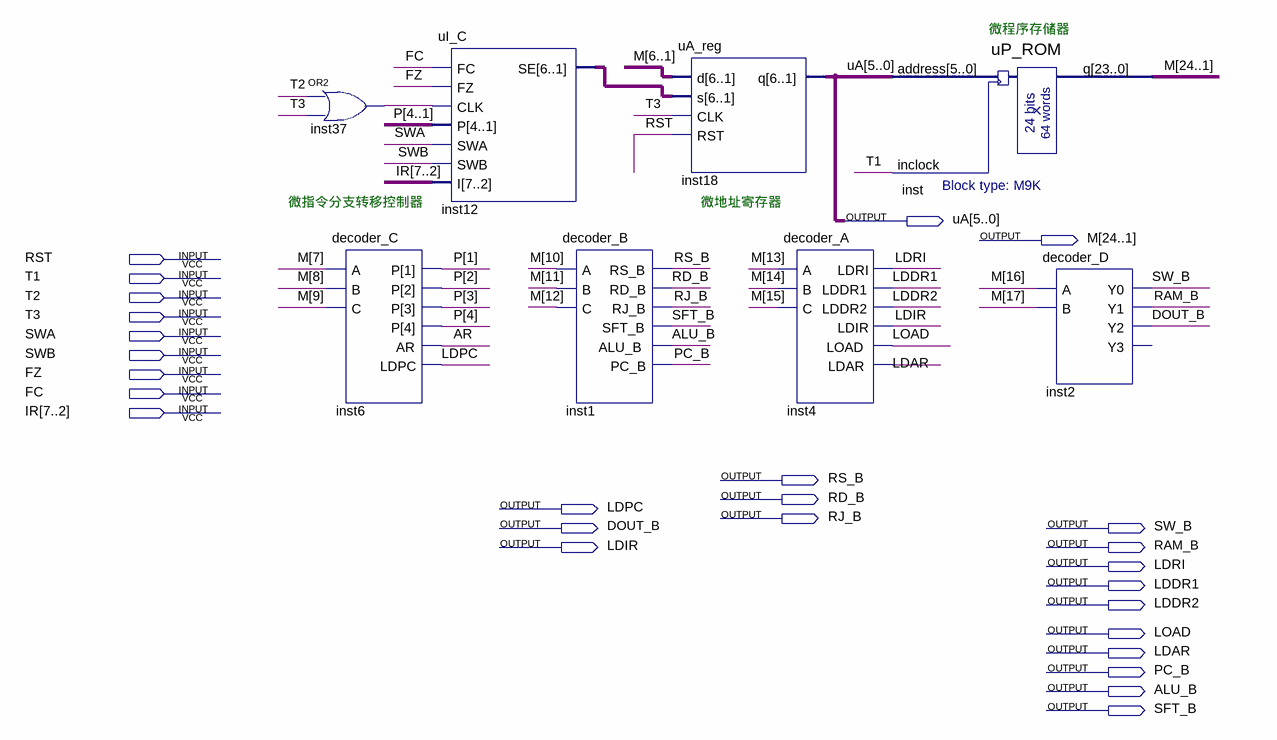
[diagram p0: schematic sheet]
// Quartus schematic uPC.bdf as structural Verilog: 8 symbols, 27 pins
module uPC (
  input  RST,
  input  T1,
  input  T2,
  input  T3,
  input  SWA,
  input  SWB,
  input  FZ,
  input  FC,
  input  [7:2] IR,
  output [5:0] uA,
  output [24:1] M,
  output RS_B,
  output RD_B,
  output LDPC,
  output RJ_B,
  output DOUT_B,
  output SW_B,
  output LDIR,
  output RAM_B,
  output LDRI,
  output LDDR1,
  output LDDR2,
  output LOAD,
  output LDAR,
  output PC_B,
  output ALU_B,
  output SFT_B
);

  wire AR, inst37_out;
  wire [4:1] P;
  wire [5:0] inst12_se;

  or inst37 (inst37_out, T2, T3);
  decoder_C inst6 (.A(M[7]), .B(M[8]), .C(M[9]), .P(P), .AR(AR), .LDPC(LDPC));
  uI_C inst12 (.FC(FC), .FZ(FZ), .CLK(inst37_out), .P(P), .SWA(SWA), .SWB(SWB), .I(IR), .SE(inst12_se));
  decoder_B inst1 (
    .A(M[10]), .B(M[11]), .C(M[12]), .RS_B(RS_B), .RD_B(RD_B), .RJ_B(RJ_B), .SFT_B(SFT_B), .ALU_B(ALU_B),
    .PC_B(PC_B));
  uA_reg inst18 (.d(M[6:1]), .s(inst12_se), .CLK(T3), .RST(RST), .q(uA));
  decoder_A inst4 (
    .A(M[13]), .B(M[14]), .C(M[15]), .LDRI(LDRI), .LDDR1(LDDR1), .LDDR2(LDDR2), .LDIR(LDIR), .LOAD(LOAD),
    .LDAR(LDAR));
  uP_ROM inst (.address(uA), .inclock(T1), .q(M));
  decoder_D inst2 (.A(M[16]), .B(M[17]), .Y0(SW_B), .Y1(RAM_B), .Y2(DOUT_B));  // open: Y3

  // Notes on the sheet:
  //   微程序存储器
  //   微指令分支转移控制器
  //   微地址寄存器
endmodule
